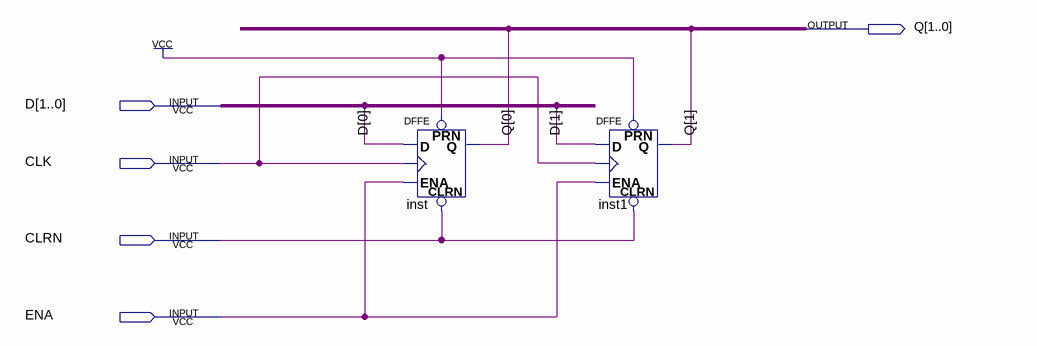
[diagram p0: schematic sheet]
// Quartus schematic REGISTRADOR2bits.bdf as structural Verilog: 2 symbols, 5 pins
module REGISTRADOR2bits (
  input  [1:0] D,
  input  CLK,
  input  CLRN,
  input  ENA,
  output [1:0] Q
);

  DFFE inst (.PRN(1'b1), .CLRN(CLRN), .D(D[0]), .CLK(CLK), .ENA(ENA), .Q(Q[0]));
  DFFE inst1 (.PRN(1'b1), .CLRN(CLRN), .D(D[1]), .CLK(CLK), .ENA(ENA), .Q(Q[1]));
endmodule
